# Altium schematic sheet Mezz2.SchDoc: FPGA Motherboard for Digital Multiplexed Readout, McGill U.
size B; DocumentNumber: DfMUX27; Revision: Rev0, Prototype; SheetNumber: 27; SheetTotal: 27; PageSetup: Record=PageOptions|CenterHorizontal=True|CenterVertical=True|PrintScale=1.08|XCorrection=1.00|YCorrection=1.00|PrintKind=0|BorderSize=5000000|LeftOffset=0|BottomOffset=0|Orientation=2|PaperLength=1000|PaperWidth=1000|Scale=100|PaperSource=7|PrintQuality=-4|MediaType=1|DitherType=10|PaperKind=Tabloid|PrintScaleMode=1
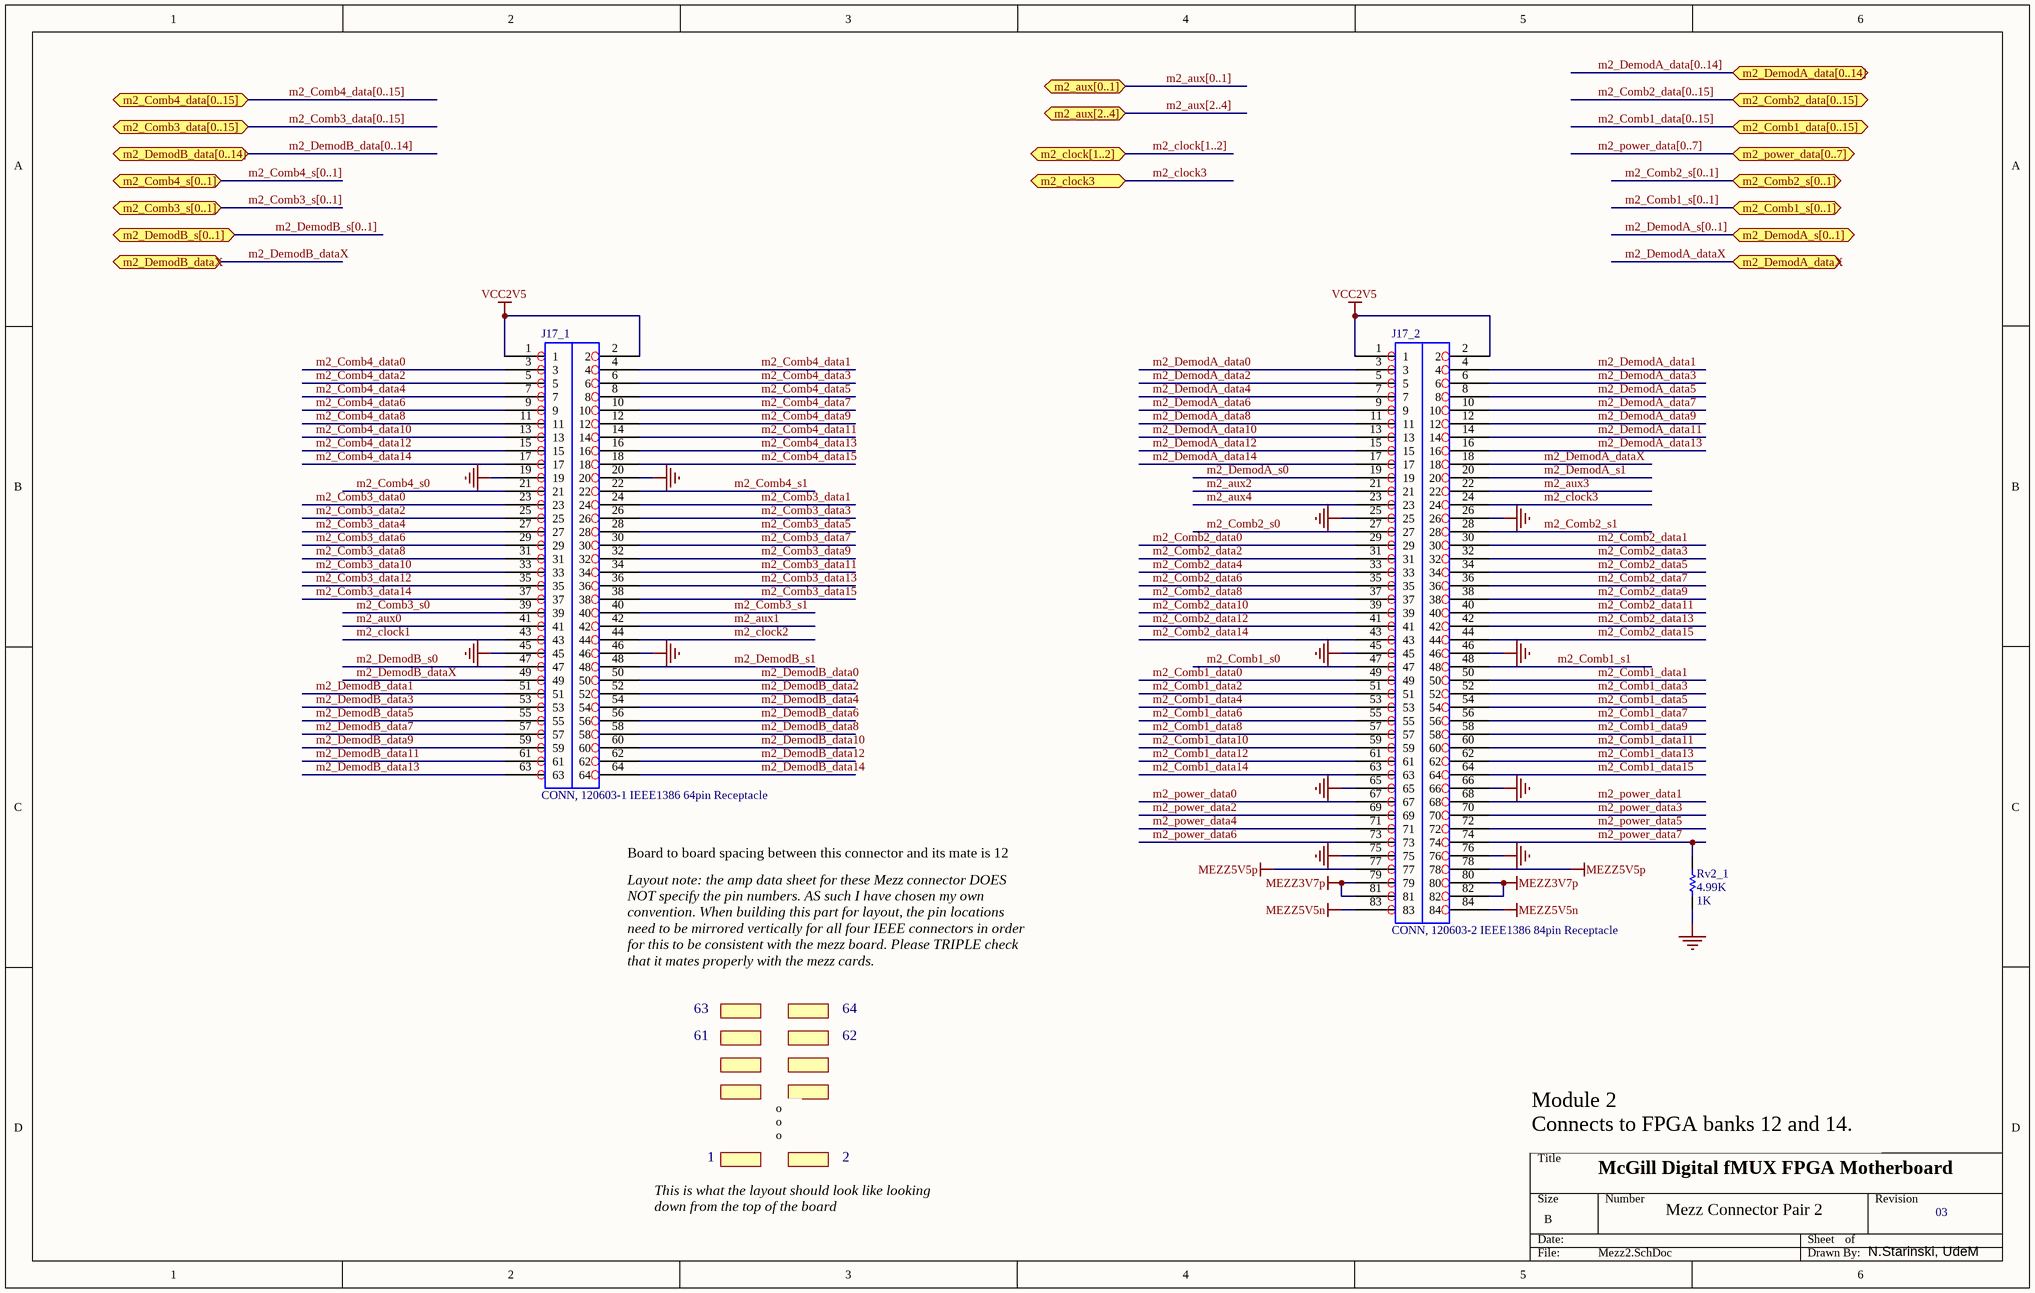
[diagram p0: Mezz2.SchDoc]

## Parts
J17_1  CONN, 120603-1 IEEE1386 64pin Receptacle  [120603-1]
J17_2  CONN, 120603-2 IEEE1386 84pin Receptacle  [120603-2]
Rv2_1  4.99K  value 1K  [1608[0603]]

## Ports
m2_aux[0..1] (bidir), m2_aux[2..4] (bidir), m2_clock3 (bidir), m2_clock[1..2] (bidir), m2_Comb1_data[0..15] (bidir), m2_Comb1_s[0..1] (bidir), m2_Comb2_data[0..15] (bidir), m2_Comb2_s[0..1] (bidir), m2_Comb3_data[0..15] (bidir), m2_Comb3_s[0..1] (bidir), m2_Comb4_data[0..15] (bidir), m2_Comb4_s[0..1] (bidir), m2_DemodA_data[0..14] (bidir), m2_DemodA_dataX (bidir), m2_DemodA_s[0..1] (bidir), m2_DemodB_data[0..14] (bidir), m2_DemodB_dataX (bidir), m2_DemodB_s[0..1] (bidir), m2_power_data[0..7] (bidir)

## Nets
GND: J17_1.19 J17_1.20 J17_1.45 J17_1.46 J17_2.25 J17_2.26 J17_2.45 J17_2.46 J17_2.65 J17_2.66 J17_2.75 J17_2.76 Rv2_1.1
MEZZ3V7p: J17_2.79 J17_2.80 J17_2.81 J17_2.82
MEZZ5V5n: J17_2.83 J17_2.84
MEZZ5V5p: J17_2.77 J17_2.78
VCC2V5: J17_1.1 J17_1.2 J17_2.1 J17_2.2
m2_aux0: J17_1.41
m2_aux1: J17_1.42
m2_aux2: J17_2.21
m2_aux3: J17_2.22
m2_aux4: J17_2.23
m2_clock1: J17_1.43
m2_clock2: J17_1.44
m2_clock3: J17_2.24 ; port m2_clock3
m2_Comb1_data0: J17_2.49
m2_Comb1_data1: J17_2.50
m2_Comb1_data2: J17_2.51
m2_Comb1_data3: J17_2.52
m2_Comb1_data4: J17_2.53
m2_Comb1_data5: J17_2.54
m2_Comb1_data6: J17_2.55
m2_Comb1_data7: J17_2.56
m2_Comb1_data8: J17_2.57
m2_Comb1_data9: J17_2.58
m2_Comb1_data10: J17_2.59
m2_Comb1_data11: J17_2.60
m2_Comb1_data12: J17_2.61
m2_Comb1_data13: J17_2.62
m2_Comb1_data14: J17_2.63
m2_Comb1_data15: J17_2.64
m2_Comb1_s0: J17_2.47
m2_Comb1_s1: J17_2.48
m2_Comb2_data0: J17_2.29
m2_Comb2_data1: J17_2.30
m2_Comb2_data2: J17_2.31
m2_Comb2_data3: J17_2.32
m2_Comb2_data4: J17_2.33
m2_Comb2_data5: J17_2.34
m2_Comb2_data6: J17_2.35
m2_Comb2_data7: J17_2.36
m2_Comb2_data8: J17_2.37
m2_Comb2_data9: J17_2.38
m2_Comb2_data10: J17_2.39
m2_Comb2_data11: J17_2.40
m2_Comb2_data12: J17_2.41
m2_Comb2_data13: J17_2.42
m2_Comb2_data14: J17_2.43
m2_Comb2_data15: J17_2.44
m2_Comb2_s0: J17_2.27
m2_Comb2_s1: J17_2.28
m2_Comb3_data0: J17_1.23
m2_Comb3_data1: J17_1.24
m2_Comb3_data2: J17_1.25
m2_Comb3_data3: J17_1.26
m2_Comb3_data4: J17_1.27
m2_Comb3_data5: J17_1.28
m2_Comb3_data6: J17_1.29
m2_Comb3_data7: J17_1.30
m2_Comb3_data8: J17_1.31
m2_Comb3_data9: J17_1.32
m2_Comb3_data10: J17_1.33
m2_Comb3_data11: J17_1.34
m2_Comb3_data12: J17_1.35
m2_Comb3_data13: J17_1.36
m2_Comb3_data14: J17_1.37
m2_Comb3_data15: J17_1.38
m2_Comb3_s0: J17_1.39
m2_Comb3_s1: J17_1.40
m2_Comb4_data0: J17_1.3
m2_Comb4_data1: J17_1.4
m2_Comb4_data2: J17_1.5
m2_Comb4_data3: J17_1.6
m2_Comb4_data4: J17_1.7
m2_Comb4_data5: J17_1.8
m2_Comb4_data6: J17_1.9
m2_Comb4_data7: J17_1.10
m2_Comb4_data8: J17_1.11
m2_Comb4_data9: J17_1.12
m2_Comb4_data10: J17_1.13
m2_Comb4_data11: J17_1.14
m2_Comb4_data12: J17_1.15
m2_Comb4_data13: J17_1.16
m2_Comb4_data14: J17_1.17
m2_Comb4_data15: J17_1.18
m2_Comb4_s0: J17_1.21
m2_Comb4_s1: J17_1.22
m2_DemodA_data0: J17_2.3
m2_DemodA_data1: J17_2.4
m2_DemodA_data2: J17_2.5
m2_DemodA_data3: J17_2.6
m2_DemodA_data4: J17_2.7
m2_DemodA_data5: J17_2.8
m2_DemodA_data6: J17_2.9
m2_DemodA_data7: J17_2.10
m2_DemodA_data8: J17_2.11
m2_DemodA_data9: J17_2.12
m2_DemodA_data10: J17_2.13
m2_DemodA_data11: J17_2.14
m2_DemodA_data12: J17_2.15
m2_DemodA_data13: J17_2.16
m2_DemodA_data14: J17_2.17
m2_DemodA_dataX: J17_2.18 ; port m2_DemodA_dataX
m2_DemodA_s0: J17_2.19
m2_DemodA_s1: J17_2.20
m2_DemodB_data0: J17_1.50
m2_DemodB_data1: J17_1.51
m2_DemodB_data2: J17_1.52
m2_DemodB_data3: J17_1.53
m2_DemodB_data4: J17_1.54
m2_DemodB_data5: J17_1.55
m2_DemodB_data6: J17_1.56
m2_DemodB_data7: J17_1.57
m2_DemodB_data8: J17_1.58
m2_DemodB_data9: J17_1.59
m2_DemodB_data10: J17_1.60
m2_DemodB_data11: J17_1.61
m2_DemodB_data12: J17_1.62
m2_DemodB_data13: J17_1.63
m2_DemodB_data14: J17_1.64
m2_DemodB_dataX: J17_1.49 ; port m2_DemodB_dataX
m2_DemodB_s0: J17_1.47
m2_DemodB_s1: J17_1.48
m2_power_data0: J17_2.67
m2_power_data1: J17_2.68
m2_power_data2: J17_2.69
m2_power_data3: J17_2.70
m2_power_data4: J17_2.71
m2_power_data5: J17_2.72
m2_power_data6: J17_2.73
m2_power_data7: J17_2.74 Rv2_1.2

## Buses and harness runs
bus m2_aux[0..1] = port m2_aux[0..1]
bus m2_aux[2..4] = port m2_aux[2..4]
bus m2_clock[1..2] = port m2_clock[1..2]
bus m2_Comb1_data[0..15] = port m2_Comb1_data[0..15]
bus m2_Comb1_s[0..1] = port m2_Comb1_s[0..1]
bus m2_Comb2_data[0..15] = port m2_Comb2_data[0..15]
bus m2_Comb2_s[0..1] = port m2_Comb2_s[0..1]
bus m2_Comb3_data[0..15] = port m2_Comb3_data[0..15]
bus m2_Comb3_s[0..1] = port m2_Comb3_s[0..1]
bus m2_Comb4_data[0..15] = port m2_Comb4_data[0..15]
bus m2_Comb4_s[0..1] = port m2_Comb4_s[0..1]
bus m2_DemodA_data[0..14] = port m2_DemodA_data[0..14]
bus m2_DemodA_s[0..1] = port m2_DemodA_s[0..1]
bus m2_DemodB_data[0..14] = port m2_DemodB_data[0..14]
bus m2_DemodB_s[0..1] = port m2_DemodB_s[0..1]
bus m2_power_data[0..7] = port m2_power_data[0..7]

## Notes on the sheet
- Board to board spacing between this connector and its mate is 12 mm.
- Layout note: the amp data sheet for these Mezz connector DOES NOT specify the pin numbers. AS such I have chosen my own convention. When building this part for layout, the pin locations need to be mirrored vertically for all four IEEE connectors in order for this to be consistent with the mezz board. Please TRIPLE check that it mates properly with the mezz cards.
- 61
- 63
- 62
- 64
- 1
- o
  o
  o
- 2
- Module 2
  Connects to FPGA banks 12 and 14.
  Located on DDR side of board.
- McGill Digital fMUX FPGA Motherboard
- This is what the layout should look like looking down from the top of the board
- Mezz Connector Pair 2
- 03
- N.Starinski, UdeM

## Library data of the parts
J17_1 = 120603-1: 1.0mm FH (IEEE1386) 64-pin Connector
J17_2 = 120603-2: 1.0mm FH (IEEE1386) 84-pin Connector
Rv2_1 = Res Semi: Semiconductor Resistor; Published: 8-Jun-2000; LatestRevisionDate: 17-Jul-2002; LatestRevisionNote: Re-released for DXP Platform.; PackageReference: AXIAL-0.5; Publisher: Altium Limited